# Altium project breath detector pcb.PrjPcb
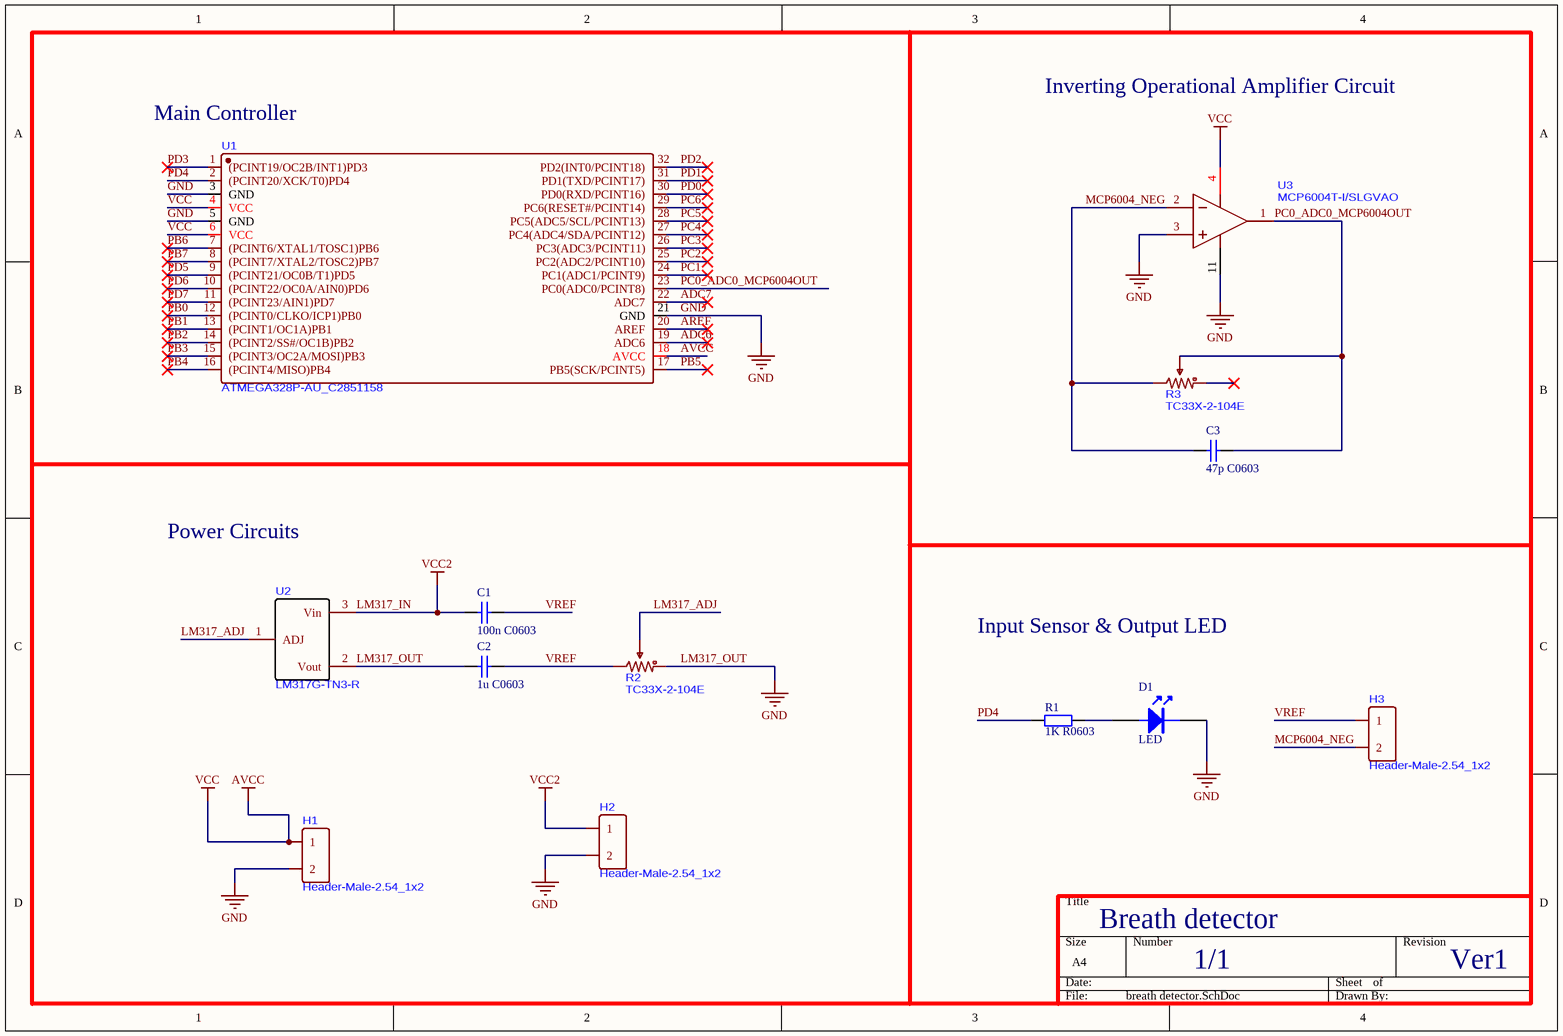
[diagram p0: breath detector.SchDoc]
1 sheet, 13 parts. Net scope: global (net labels, ports and power ports of the same name join across sheets).
Board file: breath detector.PcbDoc

## Sheet breath detector.SchDoc
size A4; SheetNumber: 1; SheetTotal: 1

### Parts
C1  100n C0603  [C 0603]
C2  1u C0603  [C 0603]
C3  47p C0603  [C 0603]
D1  LED  [LED 0805G]
H1  Header-Male-2.54_1x2  [HDR-TH_2P-P2.54-V-M-1]
H2  Header-Male-2.54_1x2  [HDR-TH_2P-P2.54-V-M-1]
H3  Header-Male-2.54_1x2  [HDR-TH_2P-P2.54-V-M-1]
R1  1K R0603  [R 0603]
R2  TC33X-2-104E  [RES-ADJ-SMD_TC33X-2-104E]
R3  TC33X-2-104E  [RES-ADJ-SMD_TC33X-2-104E]
U1  ATMEGA328P-AU_C2851158  [TQFP-32_L7.0-W7.0-P0.80-LS9.0-BL]
U2  LM317G-TN3-R  [TO-252-2_L6.6-W6.1-P4.57-LS9.9-TL-CW]
U3  MCP6004T-I/SLGVAO  [SOIC-14_L8.7-W3.9-P1.27-LS6.0-BL]

### Nets
AVCC: H1.1 U1.4(VCC) U1.6(VCC) U1.18(AVCC) U3.4(VDD)  [also labelled VCC]
GND: C2.1 D1.2 H1.2 H2.2 R2.1 U1.3(GND) U1.5(GND) U1.21(GND) U2.2(Vout) U3.3(VIN_A+) U3.11(VSS)  [also labelled LM317_OUT]
LM317_IN: C1.1 H2.1 U2.3(Vin)  [also labelled VCC2]
ADC6: U1.19(ADC6)
ADC7: U1.22(ADC7)
AREF: U1.20(AREF)
LM317_ADJ: R2.2 U2.1(ADJ)
MCP6004_NEG: C3.1 H3.2 R3.3 U3.2(VIN_A-)
PB0: U1.12((PCINT0/CLKO/ICP1)PB0)
PB1: U1.13((PCINT1/OC1A)PB1)
PB2: U1.14((PCINT2/SS#/OC1B)PB2)
PB3: U1.15((PCINT3/OC2A/MOSI)PB3)
PB4: U1.16((PCINT4/MISO)PB4)
PB5: U1.17(PB5(SCK/PCINT5))
PB6: U1.7((PCINT6/XTAL1/TOSC1)PB6)
PB7: U1.8((PCINT7/XTAL2/TOSC2)PB7)
PC0_ADC0_MCP6004OUT: C3.2 R3.2 U1.23(PC0(ADC0/PCINT8)) U3.1(VOUT_A)
PC1: U1.24(PC1(ADC1/PCINT9))
PC2: U1.25(PC2(ADC2/PCINT10))
PC3: U1.26(PC3(ADC3/PCINT11))
PC4: U1.27(PC4(ADC4/SDA/PCINT12))
PC5: U1.28(PC5(ADC5/SCL/PCINT13))
PC6: U1.29(PC6(RESET#/PCINT14))
PD0: U1.30(PD0(RXD/PCINT16))
PD1: U1.31(PD1(TXD/PCINT17))
PD2: U1.32(PD2(INT0/PCINT18))
PD3: U1.1((PCINT19/OC2B/INT1)PD3)
PD4: R1.1 U1.2((PCINT20/XCK/T0)PD4)
PD5: U1.9((PCINT21/OC0B/T1)PD5)
PD6: U1.10((PCINT22/OC0A/AIN0)PD6)
PD7: U1.11((PCINT23/AIN1)PD7)
VREF: C1.2 C2.2 H3.1 R2.3
NetD1_1: D1.1 R1.2

Not connected (* = marked no-connect by the designer): R3 1*

### Notes on the sheet
- Inverting Operational Amplifier Circuit
- (near U1) Main Controller
- Power Circuits
- Input Sensor & Output LED
- Breath detector
- 1/1
- Ver1

### Library data of the parts
C1-C3 = Cap: Value: 104; Published: 8-Jun-2000; LatestRevisionDate: 17-Jul-2002; LatestRevisionNote: Re-released for DXP Platform.; Publisher: Altium Limited
R1 = Res2: Published: 8-Jun-2000; LatestRevisionDate: 17-Jul-2002; LatestRevisionNote: Re-released for DXP Platform.; Publisher: Altium Limited